# Altium schematic sheet Power.SchDoc: HPBI Controller
size B; ApprovedBy: J Johnson; CheckedBy: J Johnson; Author: sdfasdfdfAEFfasdFfaF; DrawnBy: J Johnson; Organization: Opsero Electronic Design; Address1: 21-915 Av. Marguerite-Bourgeoys; Address2: Québec (QC); Address3: G1S 3X4; DocumentNumber: OP009-001-SCH; Revision: 1.0; SheetNumber: 13; SheetTotal: 16; Tel1: (581) 308-8830; Tel2: (581) 308-8830; Project: HPBI Controller; CheckedDate: 2013-12-13; Sheet: Power Supplies; PageSetup: Record=PageOptions|CenterHorizontal=True|CenterVertical=True|PrintScale=1.08|XCorrection=1.00|YCorrection=1.00|PrintKind=0|BorderSize=5000000|LeftOffset=0|BottomOffset=0|Orientation=2|PaperLength=1000|PaperWidth=1000|Scale=100|PaperSource=7|PrintQuality=-4|MediaType=1|DitherType=10|PaperKind=Tabloid     [11 x 17 in]|PrintScaleMode=1; DrawDate: 2013-12-13; SchTitle: HPBI Controller; RevDescription: Preliminary; RevDate: 2014-01-29; RevBy: J Johnson
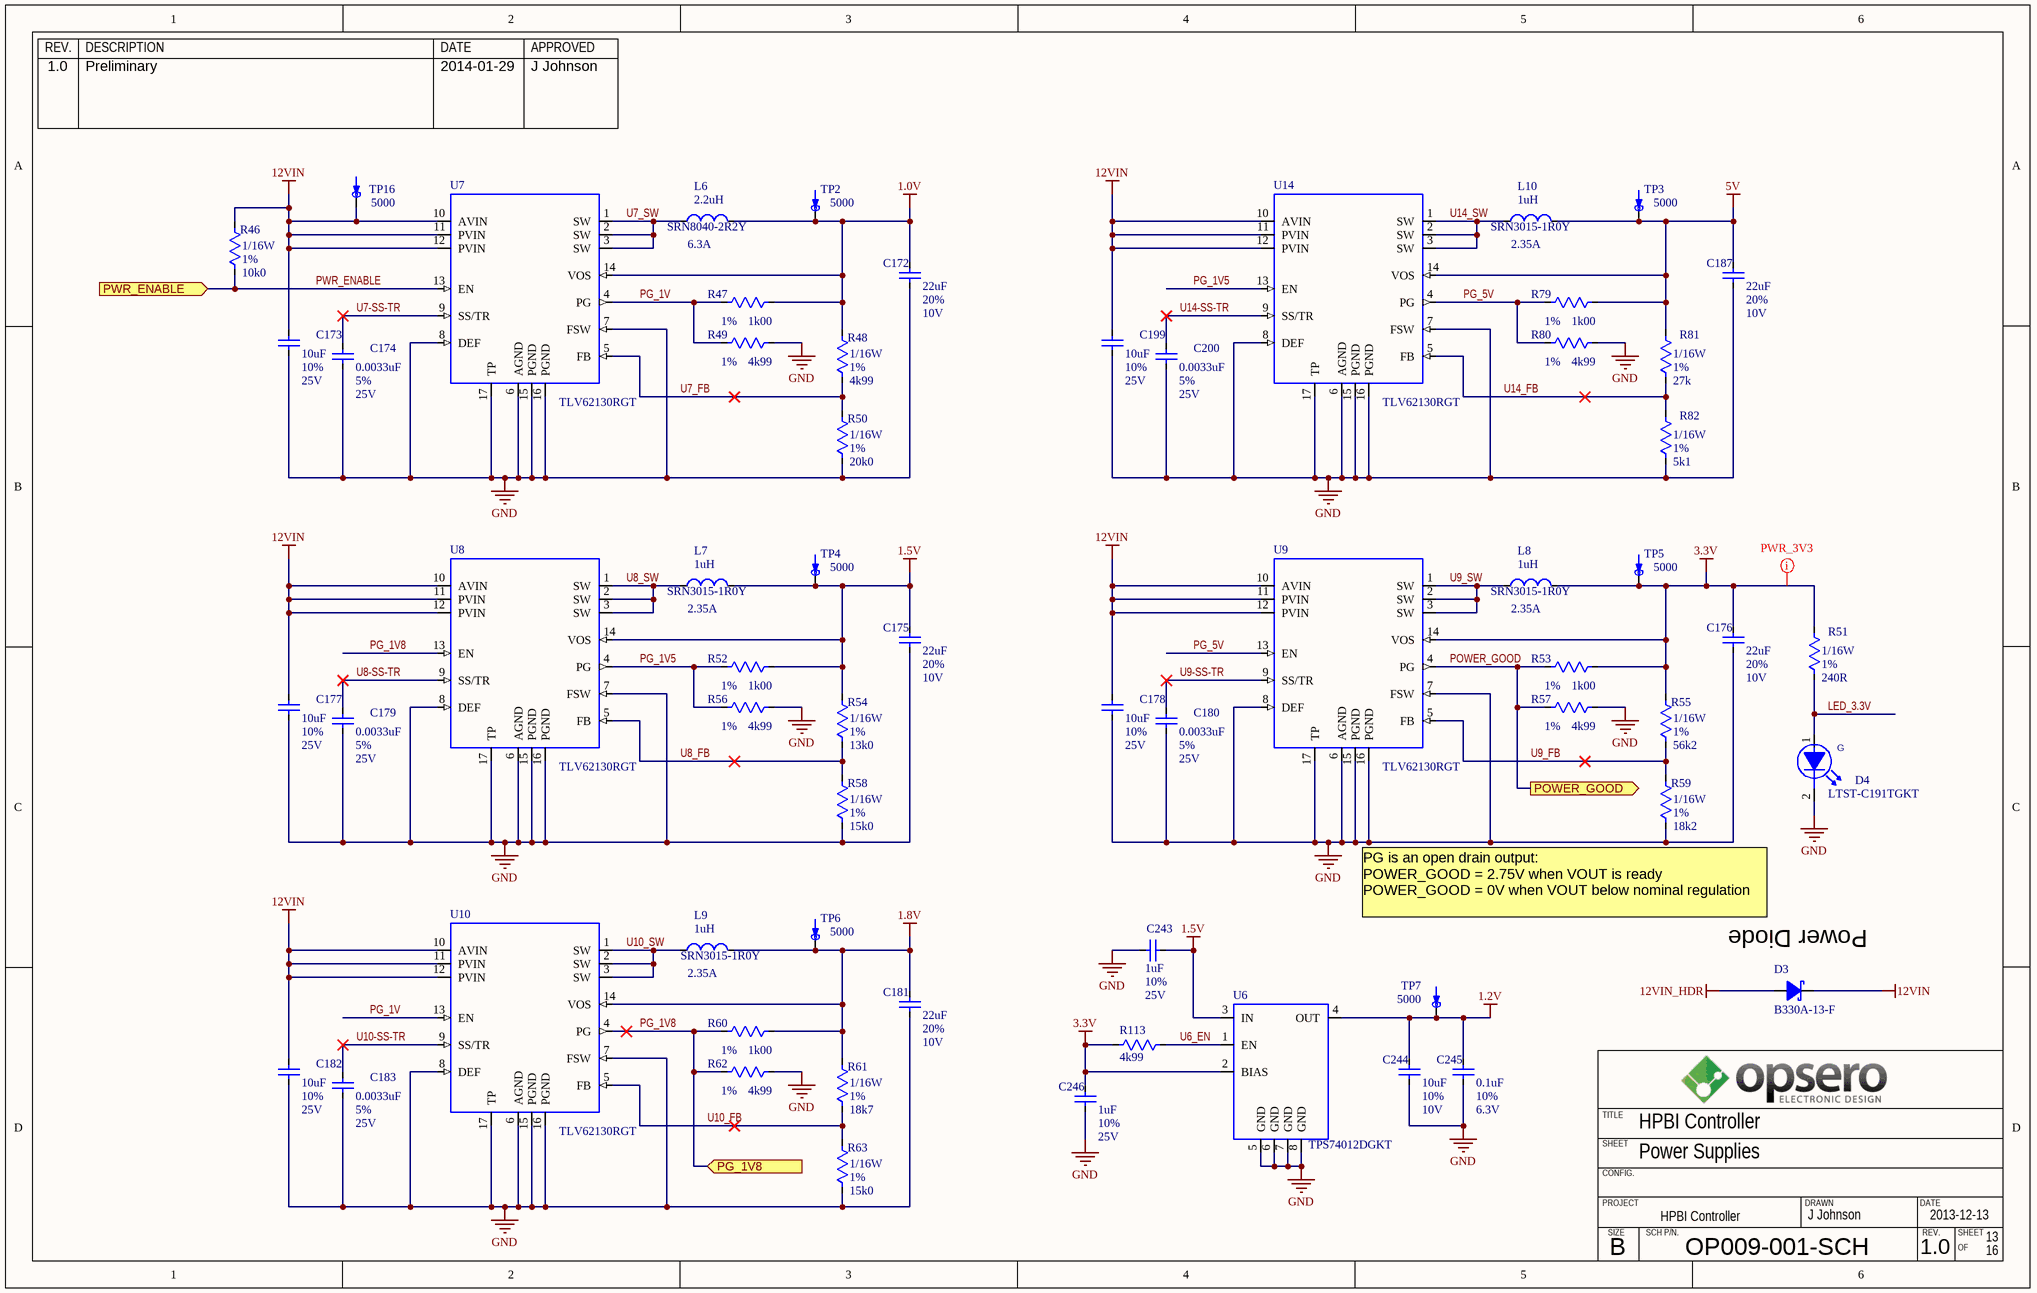
[diagram p0: Power.SchDoc]

## Parts
C172  value 22uF  Tolerance: 20%  Voltage: 10V  [CAPC2013X125N]  (hidden comment: CAPACITOR_NP_TYPE1)
C173  value 10uF  Tolerance: 10%  Voltage: 25V  [CAPC3216X127N]  (hidden comment: CAPACITOR_NP_TYPE1)
C174  value 0.0033uF  Tolerance: 5%  Voltage: 25V  [CAPC1005X55N]  (hidden comment: CAPACITOR_NP_TYPE1)
C175  value 22uF  Tolerance: 20%  Voltage: 10V  [CAPC2013X125N]  (hidden comment: CAPACITOR_NP_TYPE1)
C176  value 22uF  Tolerance: 20%  Voltage: 10V  [CAPC2013X125N]  (hidden comment: CAPACITOR_NP_TYPE1)
C177  value 10uF  Tolerance: 10%  Voltage: 25V  [CAPC3216X127N]  (hidden comment: CAPACITOR_NP_TYPE1)
C178  value 10uF  Tolerance: 10%  Voltage: 25V  [CAPC3216X127N]  (hidden comment: CAPACITOR_NP_TYPE1)
C179  value 0.0033uF  Tolerance: 5%  Voltage: 25V  [CAPC1005X55N]  (hidden comment: CAPACITOR_NP_TYPE1)
C180  value 0.0033uF  Tolerance: 5%  Voltage: 25V  [CAPC1005X55N]  (hidden comment: CAPACITOR_NP_TYPE1)
C181  value 22uF  Tolerance: 20%  Voltage: 10V  [CAPC2013X125N]  (hidden comment: CAPACITOR_NP_TYPE1)
C182  value 10uF  Tolerance: 10%  Voltage: 25V  [CAPC3216X127N]  (hidden comment: CAPACITOR_NP_TYPE1)
C183  value 0.0033uF  Tolerance: 5%  Voltage: 25V  [CAPC1005X55N]  (hidden comment: CAPACITOR_NP_TYPE1)
C187  value 22uF  Tolerance: 20%  Voltage: 10V  [CAPC2013X125N]  (hidden comment: CAPACITOR_NP_TYPE1)
C199  value 10uF  Tolerance: 10%  Voltage: 25V  [CAPC3216X127N]  (hidden comment: CAPACITOR_NP_TYPE1)
C200  value 0.0033uF  Tolerance: 5%  Voltage: 25V  [CAPC1005X55N]  (hidden comment: CAPACITOR_NP_TYPE1)
C243  value 1uF  Tolerance: 10%  Voltage: 25V  [CAPC1608X38N]  (hidden comment: CAPACITOR_NP_TYPE1)
C244  value 10uF  Tolerance: 10%  Voltage: 10V  [CAPC1608X38N]  (hidden comment: CAPACITOR_NP_TYPE1)
C245  value 0.1uF  Tolerance: 10%  Voltage: 6.3V  [CAPC0603X33N]  (hidden comment: CAPACITOR_NP_TYPE1)
C246  value 1uF  Tolerance: 10%  Voltage: 25V  [CAPC1608X38N]  (hidden comment: CAPACITOR_NP_TYPE1)
D3  Mfg Part Number 1: B330A-13-F  [DIOM4629X230N]  (hidden comment: DIODE_SCHOTTKY_TYPE1)
D4  Mfg Part Number 1: LTST-C191TGKT  [LEDM1608X38N-GRN]  (hidden comment: LED_GRN)
L6  value 2.2uH  Current: 6.3A  Mfg Part Number 1: SRN8040-2R2Y  [INDM800800X400N]  (hidden comment: INDUCTOR_TYPE1)
L7  value 1uH  Current: 2.35A  Mfg Part Number 1: SRN3015-1R0Y  [INDM300300X150N]  (hidden comment: INDUCTOR_TYPE1)
L8  value 1uH  Current: 2.35A  Mfg Part Number 1: SRN3015-1R0Y  [INDM300300X150N]  (hidden comment: INDUCTOR_TYPE1)
L9  value 1uH  Current: 2.35A  Mfg Part Number 1: SRN3015-1R0Y  [INDM300300X150N]  (hidden comment: INDUCTOR_TYPE1)
L10  value 1uH  Current: 2.35A  Mfg Part Number 1: SRN3015-1R0Y  [INDM300300X150N]  (hidden comment: INDUCTOR_TYPE1)
R46  value 10k0  Power: 1/16W  Tolerance: 1%  [RESC1005X33N]  (hidden comment: *)
R47  value 1k00  Tolerance: 1%  [RESC1005X33N]  (hidden comment: *)
R48  value 4k99  Power: 1/16W  Tolerance: 1%  [RESC1005X33N]  (hidden comment: *)
R49  value 4k99  Tolerance: 1%  [RESC1005X33N]  (hidden comment: *)
R50  value 20k0  Power: 1/16W  Tolerance: 1%  [RESC1005X33N]  (hidden comment: *)
R51  value 240R  Power: 1/16W  Tolerance: 1%  [RESC1005X33N]  (hidden comment: *)
R52  value 1k00  Tolerance: 1%  [RESC1005X33N]  (hidden comment: *)
R53  value 1k00  Tolerance: 1%  [RESC1005X33N]  (hidden comment: *)
R54  value 13k0  Power: 1/16W  Tolerance: 1%  [RESC1005X33N]  (hidden comment: *)
R55  value 56k2  Power: 1/16W  Tolerance: 1%  [RESC1005X33N]  (hidden comment: *)
R56  value 4k99  Tolerance: 1%  [RESC1005X33N]  (hidden comment: *)
R57  value 4k99  Tolerance: 1%  [RESC1005X33N]  (hidden comment: *)
R58  value 15k0  Power: 1/16W  Tolerance: 1%  [RESC1005X33N]  (hidden comment: *)
R59  value 18k2  Power: 1/16W  Tolerance: 1%  [RESC1005X33N]  (hidden comment: *)
R60  value 1k00  Tolerance: 1%  [RESC1005X33N]  (hidden comment: *)
R61  value 18k7  Power: 1/16W  Tolerance: 1%  [RESC1005X33N]  (hidden comment: *)
R62  value 4k99  Tolerance: 1%  [RESC1005X33N]  (hidden comment: *)
R63  value 15k0  Power: 1/16W  Tolerance: 1%  [RESC1005X33N]  (hidden comment: *)
R79  value 1k00  Tolerance: 1%  [RESC1005X33N]  (hidden comment: *)
R80  value 4k99  Tolerance: 1%  [RESC1005X33N]  (hidden comment: *)
R81  value 27k  Power: 1/16W  Tolerance: 1%  [RESC1005X33N]  (hidden comment: *)
R82  value 5k1  Power: 1/16W  Tolerance: 1%  [RESC1005X33N]  (hidden comment: *)
R113  value 4k99  [RESC1005X33N]  (hidden comment: *)
TP2  value 5000  [KEY_5000]  (hidden comment: TEST_POINT_TYPE4)
TP3  value 5000  [KEY_5000]  (hidden comment: TEST_POINT_TYPE4)
TP4  value 5000  [KEY_5000]  (hidden comment: TEST_POINT_TYPE4)
TP5  value 5000  [KEY_5000]  (hidden comment: TEST_POINT_TYPE4)
TP6  value 5000  [KEY_5000]  (hidden comment: TEST_POINT_TYPE4)
TP7  value 5000  [KEY_5000]  (hidden comment: TEST_POINT_TYPE4)
TP16  value 5000  [KEY_5000]  (hidden comment: TEST_POINT_TYPE4)
U6  Mfg Part Number 1: TPS74012DGKT  [SOP65P490X110-8N]  (hidden comment: TPS740XXDGK)
U7  TLV62130RGT  [QFN50P300X300X100-17N]
U8  TLV62130RGT  [QFN50P300X300X100-17N]
U9  TLV62130RGT  [QFN50P300X300X100-17N]
U10  TLV62130RGT  [QFN50P300X300X100-17N]
U14  TLV62130RGT  [QFN50P300X300X100-17N]

## Ports
PG_1V8 (in), POWER_GOOD (out), PWR_ENABLE (in)

## Nets
1.0V: C172.1 L6.2 R47.2 R48.2 TP2.1 U7.14(VOS)
1.2V: C244.1 C245.1 TP7.1 U6.4(OUT)
1.5V: C175.1 C243.1 L7.2 R52.2 R54.2 TP4.1 U6.3(IN) U8.14(VOS)
1.8V: C181.1 L9.2 R60.2 R61.2 TP6.1 U10.14(VOS)
3.3V: C176.1 C246.1 L8.2 R51.1 R53.2 R55.2 R113.2 TP5.1 U6.2(BIAS) U9.14(VOS)
5V: C187.1 L10.2 R79.2 R81.2 TP3.1 U14.14(VOS)
12VIN: C173.1 C177.1 C178.1 C182.1 C199.1 D3.2(K) R46.2 TP16.1 U7.10(AVIN) U7.11(PVIN) U7.12(PVIN) U8.10(AVIN) U8.11(PVIN) U8.12(PVIN) U9.10(AVIN) U9.11(PVIN) U9.12(PVIN) U10.10(AVIN) U10.11(PVIN) U10.12(PVIN) U14.10(AVIN) U14.11(PVIN) U14.12(PVIN)
12VIN_HDR: D3.1(A)
GND: C172.2 C173.2 C174.2 C175.2 C176.2 C177.2 C178.2 C179.2 C180.2 C181.2 C182.2 C183.2 C187.2 C199.2 C200.2 C243.2 C244.2 C245.2 C246.2 D4.2(K) R49.2 R50.1 R56.2 R57.2 R58.1 R59.1 R62.2 R63.1 R80.2 R82.1 U6.5(GND) U6.6(GND) U6.7(GND) U6.8(GND) U7.6(AGND) U7.7(FSW) U7.8(DEF) U7.15(PGND) U7.16(PGND) U7.17(TP) U8.6(AGND) U8.7(FSW) U8.8(DEF) U8.15(PGND) U8.16(PGND) U8.17(TP) U9.6(AGND) U9.7(FSW) U9.8(DEF) U9.15(PGND) U9.16(PGND) U9.17(TP) U10.6(AGND) U10.7(FSW) U10.8(DEF) U10.15(PGND) U10.16(PGND) U10.17(TP) U14.6(AGND) U14.7(FSW) U14.8(DEF) U14.15(PGND) U14.16(PGND) U14.17(TP)
LED_3.3V: D4.1(A) R51.2
PG_1V: R47.1 R49.1 U7.4(PG) U10.13(EN)
PG_1V5: R52.1 R56.1 U8.4(PG) U14.13(EN)
PG_1V8: R60.1 R62.1 U8.13(EN) U10.4(PG) ; port PG_1V8
PG_5V: R79.1 R80.1 U9.13(EN) U14.4(PG)
POWER_GOOD: R53.1 R57.1 U9.4(PG) ; port POWER_GOOD
PWR_ENABLE: R46.1 U7.13(EN) ; port PWR_ENABLE
U6_EN: R113.1 U6.1(EN)
U7-SS-TR: C174.1 U7.9(SS/TR)
U7_FB: R48.1 R50.2 U7.5(FB)
U7_SW: L6.1 U7.1(SW) U7.2(SW) U7.3(SW)
U8-SS-TR: C179.1 U8.9(SS/TR)
U8_FB: R54.1 R58.2 U8.5(FB)
U8_SW: L7.1 U8.1(SW) U8.2(SW) U8.3(SW)
U9-SS-TR: C180.1 U9.9(SS/TR)
U9_FB: R55.1 R59.2 U9.5(FB)
U9_SW: L8.1 U9.1(SW) U9.2(SW) U9.3(SW)
U10-SS-TR: C183.1 U10.9(SS/TR)
U10_FB: R61.1 R63.2 U10.5(FB)
U10_SW: L9.1 U10.1(SW) U10.2(SW) U10.3(SW)
U14-SS-TR: C200.1 U14.9(SS/TR)
U14_FB: R81.1 R82.2 U14.5(FB)
U14_SW: L10.1 U14.1(SW) U14.2(SW) U14.3(SW)

## Layout directives
net class Power_3V3: 3.3V

## Notes on the sheet
- (near R59) PG is an open drain output:
  POWER_GOOD = 2.75V when VOUT is ready
  POWER_GOOD = 0V when VOUT below nominal regulation
- (near D3) Power Diode
- REV.
- DESCRIPTION
- DATE
- APPROVED
- SHEET
- TITLE
- CONFIG.
- PROJECT
- SIZE
- SCH P/N.
- DRAWN
- B
- OF
- (in symbol LTST-C191TGKT) G

## Library data of the parts
C172 C175 C176 C181 C187 = C0805_22uF_20%_10V_X5R: Capacitor ceramic, X5R, 22uF, 10V, 20%, -55 to +85 C, EIA0805; Manufacturer 1: Taiyo; Mfg Part Number 1: LMK212BJ226MG-T; EIA(I) Package: 0805; EIA(M) Package: 2012; ASSY: USED; Status: Active; Power: *; Current: *; Part Ref: C0805_22uF_20%_10V_X5R; Comment_1: *; RoHs: True; Operating Temp: -55 to +85 C
C173 C177 C178 C182 C199 = C1206_10uF_10%_25V_X5R: Capacitor ceramic, X5R, 10uF, 25V, 10%, -55 to +125 C, EIA1206; Manufacturer 1: AVX; Mfg Part Number 1: 12063D106KAT2A; EIA(I) Package: 1206; EIA(M) Package: 3216; ASSY: USED; Status: Active; Power: *; Current: *; Part Ref: C1206_10uF_10%_25V_X5R; Comment_1: *; RoHs: True; Operating Temp: -55 to +125 C
C174 C179 C180 C183 C200 = C0402_0.0033uF_5%_25V_X7R: Capacitor ceramic, X7R, 0.0033uF, 25V, 5%, -55 to +85 C, EIA0402; Manufacturer 1: AVX; Mfg Part Number 1: 04023C332JAT2A; EIA(I) Package: 0402; EIA(M) Package: 1005; ASSY: USED; Status: Active; Power: *; Current: *; Part Ref: C0402_0.0033uF_5%_25V_X7R; Comment_1: *; RoHs: True; Operating Temp: -55 to +85 C
C243 C246 = C0603_1uF_10%_25V_X5R: Capacitor ceramic, X5R, 1uF, 25V, 10%, -55 to +85 C, EIA(M)1608; Manufacturer 1: TDK; Mfg Part Number 1: C1608X5R1E105K080AC; EIA(I) Package: 0603; EIA(M) Package: 1608; ASSY: USED; Status: Active; Power: *; Current: *; Part Ref: C0603_1uF_10%_25V_X5R; Comment_1: *; RoHs: True; Operating Temp: -55 to +85 C; Datasheet 1: ..\datasheet\Capacitor\TDK\C Series\2012-10-26
C244 = C0603_10uF_10%_10V_X5R: Capacitor ceramic, X5R, 10uF, 10V, 10%, -55 to +85 C, EIA0603; Manufacturer 1: TDK Corporation; Mfg Part Number 1: C1608X5R1A106K080AC; EIA(I) Package: 0603; EIA(M) Package: 1608; ASSY: USED; Status: Active; Power: *; Current: *; Part Ref: C0603_10uF_10%_10V_X5R; Comment_1: *; RoHs: True; Operating Temp: -55 to +85 C
C245 = C0201_0.1uF_10%_6.3V_X5R: Capacitor ceramic, X5R, 0.1uF, 6.3V, 10%, -55 to +125 C, EIA0201; Manufacturer 1: Murata; Mfg Part Number 1: GRM033R60J104KE19D; EIA(I) Package: 0201; EIA(M) Package: 0603; ASSY: USED; Status: Active; Power: *; Current: *; Part Ref: C0201_0.1uF_10%_6.3V_X5R; Comment_1: *; RoHs: True; Operating Temp: -55 to +85 C
D3 = B330A-13-F: Diode, Schottky, Vz = 30V, -55 to 125C, SMT; Manufacturer 1: Diodes Inc; Current: 3A; ASSY: USED; Voltage: Vz= 30V; Status: Active; Power: *; EIA(I) Package: *; EIA(M) Package: *; Part Ref: B330A-13-F; Tolerance: *; Comment_1: *; RoHs: True; Value: B330A-13-F; Operating Temp: -55 to +125 C
D4 = LTST-C191TGKT: Led, Green, 150mcd, SMT, LTST-C191TGKT, -20 to +80 C, 0603; Manufacturer 1: LITE-ON; EIA(I) Package: 0603; ASSY: USED; Power: Pow; Current: 20mA; Voltage: 3.2V; Status: Active; EIA(M) Package: *; Part Ref: LTST-C191TGKT; Tolerance: *; Package: *; RoHs: True; Value: LTST-C191TGKT; Operating Temp: -20 to +80 C
L6 = SRN8040-2R2Y: Inductor, shielded, 13mOhm, 2.2uH, 6.3A, 30%, -40 to +105 C; Manufacturer 1: Bourns; ASSY: USED; Status: Active; Power: *; EIA(I) Package: *; EIA(M) Package: *; Part Ref: SRN8040-2R2Y; Voltage: *; Comment_1: *; RoHs: True; Tolerance: 30%; Operating Temp: -40 to +105 C
L7-L10 = SRN3015-1R0Y: Inductor, shielded, 48mOhm, 1uH, 2.35A, 30%, -40 to +125 C; Manufacturer 1: Bourns; ASSY: USED; Status: Active; Power: *; EIA(I) Package: *; EIA(M) Package: *; Part Ref: SRN3015-1R0Y; Voltage: *; Comment_1: *; RoHs: True; Tolerance: 30%; Operating Temp: -40 to +125 C
R46 = R0402_10k0_1%: Resistor, 10k0, 1/16W, 1%, -55 to +155 C, EIA0402; Manufacturer 1: Yageo; Mfg Part Number 1: RC0402FR-0710k0L; EIA(I) Package: 0402; EIA(M) Package: 1005; Voltage: 50V; ASSY: USED; Status: Active; Part Ref: R0402_10k0_1%; Current: *; Comment_1: *; RoHs: True; Package: 0402; Operating Temp: -55 to +155 C; Datasheet 1: ..\datasheet\Resistor\Yaego\Thick_Film\RC0402\2012-03-29; Manufacturer 2: Vishay Dale; Mfg Part Number 2: CRCW040210k0FKED; Datasheet 2: ..\datasheet\Resistor\Vishay Dale\CRC\2012-03-29
R47 R52 R53 R60 R79 = R0402_1k00_1%: Resistor, 1k00, 1/16W, 1%, -55 to +155 C, EIA0402; Manufacturer 1: Yageo; Mfg Part Number 1: RC0402FR-071K00L; EIA(I) Package: 0402; EIA(M) Package: 1005; Voltage: 50V; ASSY: USED; Status: Active; Part Ref: R0402_1k00_1%; Current: *; Comment_1: *; RoHs: True; Power: 1/16W; Operating Temp: -55 to +155 C; Datasheet 1: ..\datasheet\Resistor\Yaego\Thick_Film\RC0402\2012-03-29; Manufacturer 2: Vishay Dale; Mfg Part Number 2: CRCW04021k00FKED; Datasheet 2: ..\datasheet\Resistor\Vishay Dale\CRC\2012-03-29
R48 R49 R56 R57 R62 R80 R113 = R0402_4k99_1%: Resistor, 4k99, 1/16W, 1%, -50 to +155 C, EIA0402, EIA(M)1005; Manufacturer 1: Yageo; Mfg Part Number 1: RC0402FR-074k99L; EIA(I) Package: 0402; EIA(M) Package: 1005; Voltage: 50V; ASSY: USED; Status: Active; Part Ref: R0402_4k99_1%; Current: *; Comment_1: *; RoHs: True; Operating Temp: -50 to +155 C; Datasheet 1: ..\datasheet\Resistor\Yaego\Thick_Film\RC0402\2012-03-29; Manufacturer 2: Vishay Dale; Mfg Part Number 2: CRCW04024k99FKED; Datasheet 2: ..\datasheet\Resistor\Vishay Dale\CRC\2012-03-29
  R49 R56 R57 R62 R80: Power: 1/16W
  R113: Power: 1/16W; Tolerance: 1%
R50 = R0402_20k0_1%: Resistor, 20k0, 1/16W, 1%, -50 to +155 C, EIA0402, EIA(M)1005; Manufacturer 1: Yageo; Mfg Part Number 1: RC0402FR-0720k0L; EIA(I) Package: 0402; EIA(M) Package: 1005; Voltage: 50V; ASSY: USED; Status: Active; Part Ref: R0402_20k0_1%; Current: *; Comment_1: *; RoHs: True; Operating Temp: -50 to +155 C; Datasheet 1: ..\datasheet\Resistor\Yaego\Thick_Film\RC0402\2012-03-29; Manufacturer 2: Vishay Dale; Mfg Part Number 2: CRCW040220k0FKED; Datasheet 2: ..\datasheet\Resistor\Vishay Dale\CRC\2012-03-29
R51 = R0402_240R_1%: Resistor, 240R, 1/16W, 1%, -50 to +155 C, EIA0402, EIA(M)1005; Manufacturer 1: Vishay Dale; Mfg Part Number 1: CRCW0402240RFKED; EIA(I) Package: 0402; EIA(M) Package: 1005; Voltage: 50V; ASSY: USED; Status: Active; Part Ref: R0402_240R_1%; Current: *; Comment_1: *; RoHs: True; Operating Temp: -50 to +155 C
R54 = R0402_13k0_1%: Resistor, 13k0, 1/16W, 1%, -50 to +155 C, EIA0402, EIA(M)1005; Manufacturer 1: Yageo; Mfg Part Number 1: RC0402FR-0713k0L; EIA(I) Package: 0402; EIA(M) Package: 1005; Voltage: 50V; ASSY: USED; Status: Active; Part Ref: R0402_13k0_1%; Current: *; Comment_1: *; RoHs: True; Operating Temp: -50 to +155 C; Datasheet 1: ..\datasheet\Resistor\Yaego\Thick_Film\RC0402\2012-03-29; Manufacturer 2: Vishay Dale; Mfg Part Number 2: CRCW040213k0FKED; Datasheet 2: ..\datasheet\Resistor\Vishay Dale\CRC\2012-03-29
R55 = R0402_56k2_1%: Resistor, 56k2, 1/16W, 1%, -50 to +155 C, EIA0402, EIA(M)1005; Manufacturer 1: Yageo; Mfg Part Number 1: RC0402FR-0756k2L; EIA(I) Package: 0402; EIA(M) Package: 1005; Voltage: 50V; ASSY: USED; Status: Active; Part Ref: R0402_56k2_1%; Current: *; Comment_1: *; RoHs: True; Operating Temp: -50 to +155 C; Datasheet 1: ..\datasheet\Resistor\Yaego\Thick_Film\RC0402\2012-03-29; Manufacturer 2: Vishay Dale; Mfg Part Number 2: CRCW040256k2FKED; Datasheet 2: ..\datasheet\Resistor\Vishay Dale\CRC\2012-03-29
R58 R63 = R0402_15k0_1%: Resistor, 15k0, 1/16W, 1%, -50 to +155 C, EIA0402, EIA(M)1005; Manufacturer 1: Yageo; Mfg Part Number 1: RC0402FR-0715k0L; EIA(I) Package: 0402; EIA(M) Package: 1005; Voltage: 50V; ASSY: USED; Status: Active; Part Ref: R0402_15k0_1%; Current: *; Comment_1: *; RoHs: True; Operating Temp: -50 to +155 C; Datasheet 1: ..\datasheet\Resistor\Yaego\Thick_Film\RC0402\2012-03-29; Manufacturer 2: Vishay Dale; Mfg Part Number 2: CRCW040215k0FKED; Datasheet 2: ..\datasheet\Resistor\Vishay Dale\CRC\2012-03-29
R59 = R0402_18k2_1%: Resistor, 18k2, 1/16W, 1%, -50 to +155 C, EIA0402, EIA(M)1005; Manufacturer 1: Yageo; Mfg Part Number 1: RC0402FR-0718k2L; EIA(I) Package: 0402; EIA(M) Package: 1005; Voltage: 50V; ASSY: USED; Status: Active; Part Ref: R0402_18k2_1%; Current: *; Comment_1: *; RoHs: True; Operating Temp: -50 to +155 C; Datasheet 1: ..\datasheet\Resistor\Yaego\Thick_Film\RC0402\2012-03-29; Manufacturer 2: Vishay Dale; Mfg Part Number 2: CRCW040218k2FKED; Datasheet 2: ..\datasheet\Resistor\Vishay Dale\CRC\2012-03-29
R61 = R0402_18k7_1%: Resistor, 18k7, 1/16W, 1%, -50 to +155 C, EIA0402, EIA(M)1005; Manufacturer 1: Yageo; Mfg Part Number 1: RC0402FR-0718k7L; EIA(I) Package: 0402; EIA(M) Package: 1005; Voltage: 50V; ASSY: USED; Status: Active; Part Ref: R0402_18k7_1%; Current: *; Comment_1: *; RoHs: True; Operating Temp: -50 to +155 C; Datasheet 1: ..\datasheet\Resistor\Yaego\Thick_Film\RC0402\2012-03-29; Manufacturer 2: Vishay Dale; Mfg Part Number 2: CRCW040218k7FKED; Datasheet 2: ..\datasheet\Resistor\Vishay Dale\CRC\2012-03-29
R81 = R0402_27k0_1%: Resistor, 27k0, 1/16W, 1%, -50 to +155 C, EIA0402, EIA(M)1005; Manufacturer 1: Yageo; Mfg Part Number 1: RC0402FR-0727kL; EIA(I) Package: 0402; EIA(M) Package: 1005; Voltage: 50V; ASSY: USED; Status: Active; Part Ref: R0402_27k0_1%; Current: *; Comment_1: *; RoHs: True; Operating Temp: -50 to +155 C; Datasheet 1: ..\datasheet\Resistor\Yaego\Thick_Film\RC0402\2012-03-29; Manufacturer 2: Vishay Dale; Mfg Part Number 2: CRCW040227k0FKED; Datasheet 2: ..\datasheet\Resistor\Vishay Dale\CRC\2012-03-29
R82 = R0402_5k10_1%: Resistor, 5k10, 1/16W, 1%, -50 to +155 C, EIA0402, EIA(M)1005; Manufacturer 1: Yageo; Mfg Part Number 1: RC0402FR-075k1L; EIA(I) Package: 0402; EIA(M) Package: 1005; Voltage: 50V; ASSY: USED; Status: Active; Part Ref: R0402_5k10_1%; Current: *; Comment_1: *; RoHs: True; Operating Temp: -50 to +155 C; Datasheet 1: ..\datasheet\Resistor\Yaego\Thick_Film\RC0402\2012-03-29; Manufacturer 2: Vishay Dale; Mfg Part Number 2: CRCW04025k10FKED; Datasheet 2: ..\datasheet\Resistor\Vishay Dale\CRC\2012-03-29
TP2-TP7 TP16 = 5000: Test point bead, red, Keystone Electronics, Thru-hole,; Manufacturer 1: Keystone inc; ASSY: USED; Power: Pow; Current: Cur; Voltage: Vol; Comment_1: Com; Status: Active; EIA(I) Package: *; EIA(M) Package: *; Part Ref: 5000; Tolerance: *; Package: *; RoHs: True; Mfg Part Number 1: 5000; Datasheet 1: ..\datasheet\Connector\Keystone Electronics\5001-5014\2012-06-28
U6 = TPS74012DGKT: Fixed 1.2V LDO Regulator with Dual Input Voltages, -40 to +85 C; Manufacturer 1: Texas Instruments; Current: 1.5A; PART NUMBER: TPS740XXDGK; Part Ref: TPS74012DGKT; Status: Active; RoHs: True; Value: TPS74012DGKT; Voltage: 1.2V; Operating Temp: -40 to +125 C
U7-U10 U14 = TLV62130RGT: Step-Down Converter with DCS-Control, 4-17V 3A, 16QFN; Manufacturer 1: Texas Instruments; Voltage: 4 to 17V; PART NUMBER: TLV62130RGT; Part Ref: TLV62130RGT; Status: Active; RoHs: True; Value: TLV62130RGT; Current: 3A; Operating Temp: -40 to +85 C; Mfg Part Number 1: TLV62130RGT